# Altium schematic sheet Z-Axis Stepper Motor Driver.SchDoc
size A; SheetNumber: 1; SheetTotal: 1
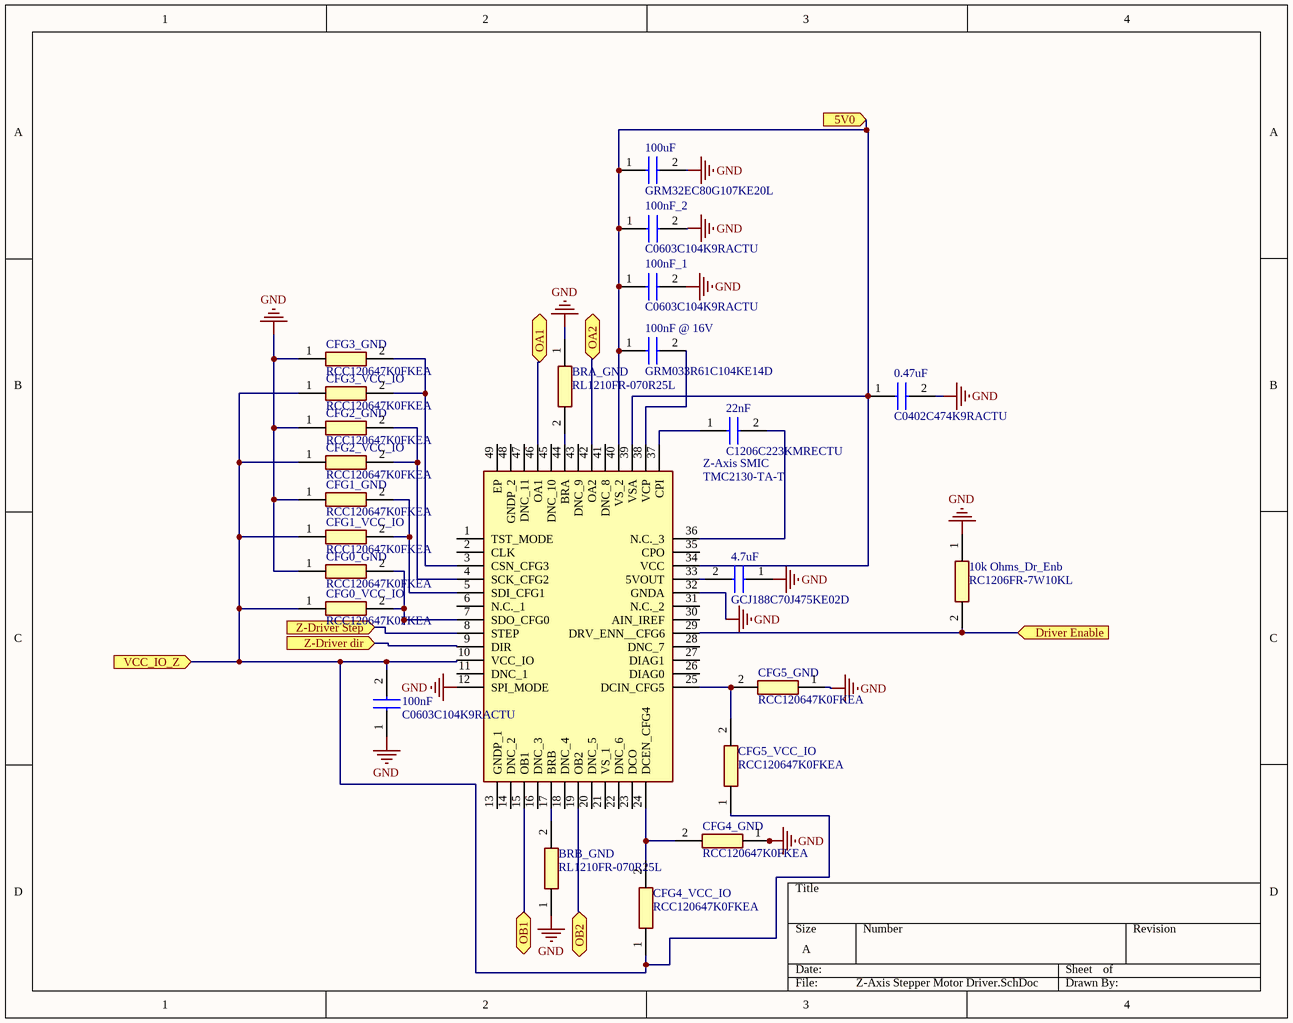
[diagram p0: Z-Axis Stepper Motor Driver.SchDoc]

## Parts
0.47uF  C0402C474K9RACTU  [CAPC1005X55N]
4.7uF  GCJ188C70J475KE02D  [CAPC1608X100N]
10k_Ohms_Dr_Enb  RC1206FR-7W10KL  [RESC3116X65N]
22nF  C1206C223KMRECTU  [C1206]
100nF  C0603C104K9RACTU  [C0603]
100nF_1  C0603C104K9RACTU  [C0603]
100nF_2  C0603C104K9RACTU  [C0603]
100nF_@_16V  GRM033R61C104KE14D  [CAPC0603X33N]
100uF  GRM32EC80G107KE20L  [CAPC3225X270N]
BRA_GND  RL1210FR-070R25L  [RESC3126X65N]
BRB_GND  RL1210FR-070R25L  [RESC3126X65N]
CFG0_GND  RCC120647K0FKEA  [RCC1206_e3]
CFG0_VCC_IO  RCC120647K0FKEA  [RCC1206_e3]
CFG1_GND  RCC120647K0FKEA  [RCC1206_e3]
CFG1_VCC_IO  RCC120647K0FKEA  [RCC1206_e3]
CFG2_GND  RCC120647K0FKEA  [RCC1206_e3]
CFG2_VCC_IO  RCC120647K0FKEA  [RCC1206_e3]
CFG3_GND  RCC120647K0FKEA  [RCC1206_e3]
CFG3_VCC_IO  RCC120647K0FKEA  [RCC1206_e3]
CFG4_GND  RCC120647K0FKEA  [RCC1206_e3]
CFG4_VCC_IO  RCC120647K0FKEA  [RCC1206_e3]
CFG5_GND  RCC120647K0FKEA  [RCC1206_e3]
CFG5_VCC_IO  RCC120647K0FKEA  [RCC1206_e3]
Z-Axis_SMIC  TMC2130-TA-T  [QFP50P900X900X120-49N]

## Ports
5V0 (in), Driver Enable (in), OA1 (bidir), OA2 (bidir), OB1 (bidir), OB2 (bidir), VCC_IO_Z (in), Z-Driver dir (in), Z-Driver Step (in)

## Nets
GND: 0.47uF.2 4.7uF.1 10k_Ohms_Dr_Enb.1 100nF.1 100nF_1.2 100nF_2.2 100uF.2 BRA_GND.1 BRB_GND.1 CFG0_GND.1 CFG1_GND.1 CFG2_GND.1 CFG3_GND.1 CFG4_GND.1 CFG5_GND.1 Z-Axis_SMIC.12(SPI_MODE) Z-Axis_SMIC.32(GNDA)
5V0: 0.47uF.1 100nF_1.1 100nF_2.1 100nF_@_16V.1 100uF.1 Z-Axis_SMIC.34(VCC) Z-Axis_SMIC.39(VSA) Z-Axis_SMIC.40(VS_2) ; port 5V0
Driver Enable: 10k_Ohms_Dr_Enb.2 Z-Axis_SMIC.29(DRV_ENN__CFG6) ; port Driver Enable
OA1: Z-Axis_SMIC.46(OA1) ; port OA1
OA2: Z-Axis_SMIC.42(OA2) ; port OA2
OB1: Z-Axis_SMIC.15(OB1) ; port OB1
OB2: Z-Axis_SMIC.19(OB2) ; port OB2
VCC_IO_Z: 100nF.2 CFG0_VCC_IO.1 CFG1_VCC_IO.1 CFG2_VCC_IO.1 CFG3_VCC_IO.1 CFG4_VCC_IO.1 CFG5_VCC_IO.1 Z-Axis_SMIC.10(VCC_IO) ; port VCC_IO_Z
Z-Driver dir: Z-Axis_SMIC.9(DIR) ; port Z-Driver dir
Z-Driver Step: Z-Axis_SMIC.8(STEP) ; port Z-Driver Step
Net4.7uF_2: 4.7uF.2 Z-Axis_SMIC.33(5VOUT)
Net22nF_1: 22nF.1 Z-Axis_SMIC.37(CPI)
Net22nF_2: 22nF.2 Z-Axis_SMIC.36(N.C._3)
Net100nF_@_16V_2: 100nF_@_16V.2 Z-Axis_SMIC.38(VCP)
NetBRA_GND_2: BRA_GND.2 Z-Axis_SMIC.44(BRA)
NetBRB_GND_2: BRB_GND.2 Z-Axis_SMIC.17(BRB)
NetCFG0_GND_2: CFG0_GND.2 CFG0_VCC_IO.2 Z-Axis_SMIC.7(SDO_CFG0)
NetCFG1_GND_2: CFG1_GND.2 CFG1_VCC_IO.2 Z-Axis_SMIC.5(SDI_CFG1)
NetCFG2_GND_2: CFG2_GND.2 CFG2_VCC_IO.2 Z-Axis_SMIC.4(SCK_CFG2)
NetCFG3_GND_2: CFG3_GND.2 CFG3_VCC_IO.2 Z-Axis_SMIC.3(CSN_CFG3)
NetCFG4_GND_2: CFG4_GND.2 CFG4_VCC_IO.2 Z-Axis_SMIC.24(DCEN_CFG4)
NetCFG5_GND_2: CFG5_GND.2 CFG5_VCC_IO.2 Z-Axis_SMIC.25(DCIN_CFG5)

Not connected (* = marked no-connect by the designer): Z-Axis_SMIC 1(TST_MODE) 2(CLK) 6(N.C._1) 11(DNC_1) 13(GNDP_1) 14(DNC_2) 16(DNC_3) 18(DNC_4) 20(DNC_5) 21(VS_1) 22(DNC_6) 23(DCO) 26(DIAG0) 27(DIAG1) 28(DNC_7) 30(AIN_IREF) 31(N.C._2) 35(CPO) 41(DNC_8) 43(DNC_9) 45(DNC_10) 47(DNC_11) 48(GNDP_2) 49(EP)

## Library data of the parts
0.47uF = C0402C474K9RACTU: Capacitor; Manufacturer_Name: KEMET; Datasheet Link: https://content.kemet.com/datasheets/KEM_C1002_X7R_SMD.pdf; Height: 0.55mm; Manufacturer_Part_Number: C0402C474K9RACTU; Mouser Part Number: 80-C0402C474K9RACTU; Mouser Price/Stock: https://www.mouser.co.uk/ProductDetail/KEMET/C0402C474K9RACTU?qs=iLbezkQI%252BshEQvJDr%2FWmpQ%3D%3D
4.7uF = GCJ188C70J475KE02D: Capacitor; Manufacturer_Name: Murata Electronics; Datasheet Link: https://psearch.en.murata.com/capacitor/product/GCJ188C70J475KE02%23.html; Height: 1mm; Manufacturer_Part_Number: GCJ188C70J475KE02D; Mouser Part Number: 81-GCJ188C70J475KE2D; Mouser Price/Stock: https://www.mouser.co.uk/ProductDetail/Murata-Electronics/GCJ188C70J475KE02D?qs=QzBtWTOodeVfJR8CElrI4A%3D%3D; Arrow Part Number: GCJ188C70J475KE02D; Arrow Price/Stock: https://www.arrow.com/en/products/gcj188c70j475ke02d/murata-manufacturing?region=nac
10k_Ohms_Dr_Enb = RC1206FR-7W10KL: Resistor; Manufacturer_Name: KEMET; Datasheet Link: https://datasheet.datasheetarchive.com/originals/distributors/Datasheets_SAMA/902f9e387b938f871d31120f5fc1d65e.pdf; Height: 0.65mm; Manufacturer_Part_Number: RC1206FR-7W10KL; Arrow Part Number: RC1206FR-7W10KL; Arrow Price/Stock: https://www.arrow.com/en/products/rc1206fr-7w10kl/yageo
22nF = C1206C223KMRECTU: Capacitor; Manufacturer_Name: KEMET; Datasheet Link: https://content.kemet.com/datasheets/KEM_C1090_X7R_ESD.pdf; Manufacturer_Part_Number: C1206C223KMRECTU; Mouser Part Number: 80-C1206C223KMRECTU; Mouser Price/Stock: https://www.mouser.co.uk/ProductDetail/KEMET/C1206C223KMRECTU?qs=55YtniHzbhA1XbH3T1d9uw%3D%3D
100nF 100nF_1 100nF_2 = C0603C104K9RACTU: Capacitor; Manufacturer_Name: KEMET; Datasheet Link: https://content.kemet.com/datasheets/KEM_C1002_X7R_SMD.pdf; Height: 0.87mm; Manufacturer_Part_Number: C0603C104K9RACTU; Mouser Part Number: 80-C0603C104K9R; Mouser Price/Stock: https://www.mouser.co.uk/ProductDetail/KEMET/C0603C104K9RACTU?qs=7q2aiX3GdliuPZzPpldOsA%3D%3D; Arrow Part Number: C0603C104K9RACTU; Arrow Price/Stock: https://www.arrow.com/en/products/c0603c104k9ractu/kemet-corporation?region=nac
100nF_@_16V = GRM033R61C104KE14D: Capacitor; Manufacturer_Name: Murata Electronics; Datasheet Link: https://psearch.en.murata.com/capacitor/product/GRM033R61C104KE14%23.html; Height: 0.33mm; Manufacturer_Part_Number: GRM033R61C104KE14D; Mouser Part Number: 81-GRM033R61C104KE4D; Mouser Price/Stock: https://www.mouser.co.uk/ProductDetail/Murata-Electronics/GRM033R61C104KE14D?qs=jHkklCh7amhDvY8zUHp0eA%3D%3D; Arrow Part Number: GRM033R61C104KE14D; Arrow Price/Stock: https://www.arrow.com/en/products/grm033r61c104ke14d/murata-manufacturing?region=nac
100uF = GRM32EC80G107KE20L: Capacitor; Manufacturer_Name: Murata Electronics; Datasheet Link: https://datasheet.datasheetarchive.com/originals/distributors/DKDS-10/192475.pdf; Height: 2.7mm; Manufacturer_Part_Number: GRM32EC80G107KE20L; Mouser Part Number: 81-GRM32EC80G107KE0L; Mouser Price/Stock: https://www.mouser.co.uk/ProductDetail/Murata-Electronics/GRM32EC80G107KE20L?qs=eeBpzGFlv%252B8VEtl0LRYzNQ%3D%3D; Arrow Part Number: GRM32EC80G107KE20L; Arrow Price/Stock: https://www.arrow.com/en/products/grm32ec80g107ke20l/murata-manufacturing
BRA_GND BRB_GND = RL1210FR-070R25L: Resistor; Manufacturer_Name: KEMET; Datasheet Link: https://www.mouser.de/datasheet/2/447/PYu-RL_Group_521_RoHS_L_2-1131815.pdf; Height: 0.65mm; Manufacturer_Part_Number: RL1210FR-070R25L; Mouser Part Number: 603-RL1210FR-070R25L; Mouser Price/Stock: https://www.mouser.co.uk/ProductDetail/Yageo/RL1210FR-070R25L?qs=k2KEx2DUIRR2Lho3B1zagg%3D%3D
CFG0_GND CFG0_VCC_IO CFG1_GND CFG1_VCC_IO CFG2_GND CFG2_VCC_IO CFG3_GND CFG3_VCC_IO CFG4_GND CFG4_VCC_IO CFG5_GND CFG5_VCC_IO = RCC120647K0FKEA: Resistor; Manufacturer_Name: Vishay; Datasheet Link: https://www.vishay.com/docs/20066/rcce3.pdf; Height: 0.6mm; Manufacturer_Part_Number: RCC120647K0FKEA; Mouser Part Number: 71-RCC120647K0FKEA; Mouser Price/Stock: https://www.mouser.co.uk/ProductDetail/Vishay-Dale/RCC120647K0FKEA?qs=IS%252B4QmGtzzrgga70d3fY5w%3D%3D
Z-Axis_SMIC = TMC2130-TA-T: Integrated Circuit; Manufacturer_Name: TRINAMIC; Datasheet Link: https://www.trinamic.com/fileadmin/assets/Products/ICs_Documents/TMC2130_datasheet.pdf; Height: 1.2mm; Manufacturer_Part_Number: TMC2130-TA-T; Mouser Part Number: 700-TMC2130-TA-T; Mouser Price/Stock: https://www.mouser.co.uk/ProductDetail/Trinamic/TMC2130-TA-T?qs=TiOZkKH1s2SorQX5NhxZsQ%3D%3D